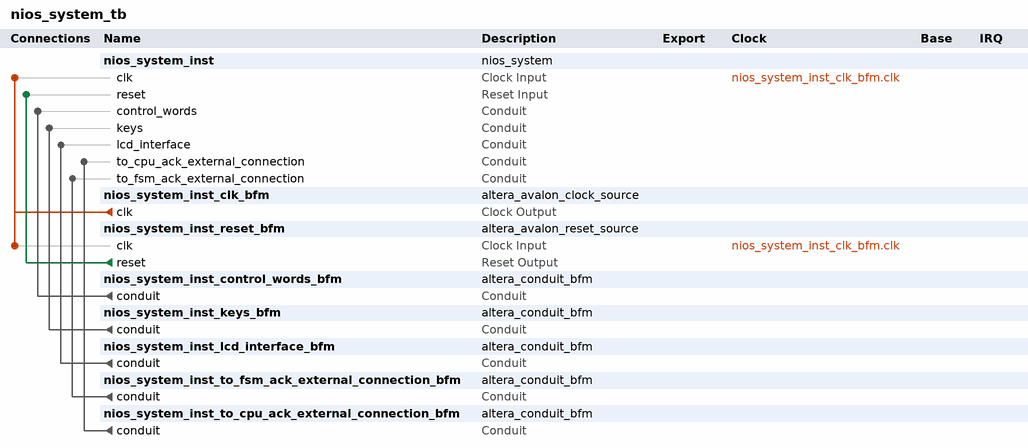
[diagram p0: system contents]
# Platform Designer (Qsys) system nios_system_tb, Cyclone IV E EP4CE115F29C7
# Parameters at their usual value, and those the tool derives, are not listed.
package require -exact qsys 13.0
create_system nios_system_tb
set_project_property DEVICE_FAMILY {Cyclone IV E}
set_project_property DEVICE EP4CE115F29C7

add_instance nios_system_inst nios_system 1.0

add_instance nios_system_inst_clk_bfm altera_avalon_clock_source 13.0

add_instance nios_system_inst_reset_bfm altera_avalon_reset_source 13.0
set_instance_parameter_value nios_system_inst_reset_bfm ASSERT_HIGH_RESET 0
set_instance_parameter_value nios_system_inst_reset_bfm INITIAL_RESET_CYCLES 50

add_instance nios_system_inst_control_words_bfm altera_conduit_bfm 13.0
set_instance_parameter_value nios_system_inst_control_words_bfm CLOCKED_SIGNAL false
set_instance_parameter_value nios_system_inst_control_words_bfm ENABLE_RESET false
set_instance_parameter_value nios_system_inst_control_words_bfm SIGNAL_WIDTHS 8
set_instance_parameter_value nios_system_inst_control_words_bfm SIGNAL_DIRECTIONS input

add_instance nios_system_inst_keys_bfm altera_conduit_bfm 13.0
set_instance_parameter_value nios_system_inst_keys_bfm CLOCKED_SIGNAL false
set_instance_parameter_value nios_system_inst_keys_bfm ENABLE_RESET false
set_instance_parameter_value nios_system_inst_keys_bfm SIGNAL_WIDTHS 3
set_instance_parameter_value nios_system_inst_keys_bfm SIGNAL_DIRECTIONS output

add_instance nios_system_inst_lcd_interface_bfm altera_conduit_bfm 13.0
set_instance_parameter_value nios_system_inst_lcd_interface_bfm CLOCKED_SIGNAL false
set_instance_parameter_value nios_system_inst_lcd_interface_bfm ENABLE_RESET false
set_instance_parameter_value nios_system_inst_lcd_interface_bfm SIGNAL_ROLES DATA,ON,BLON,EN,RS,RW
set_instance_parameter_value nios_system_inst_lcd_interface_bfm SIGNAL_WIDTHS 8,1,1,1,1,1
set_instance_parameter_value nios_system_inst_lcd_interface_bfm SIGNAL_DIRECTIONS bidir,input,input,input,input,input

add_instance nios_system_inst_to_fsm_ack_external_connection_bfm altera_conduit_bfm 13.0
set_instance_parameter_value nios_system_inst_to_fsm_ack_external_connection_bfm CLOCKED_SIGNAL false
set_instance_parameter_value nios_system_inst_to_fsm_ack_external_connection_bfm ENABLE_RESET false
set_instance_parameter_value nios_system_inst_to_fsm_ack_external_connection_bfm SIGNAL_WIDTHS 1
set_instance_parameter_value nios_system_inst_to_fsm_ack_external_connection_bfm SIGNAL_DIRECTIONS input

add_instance nios_system_inst_to_cpu_ack_external_connection_bfm altera_conduit_bfm 13.0
set_instance_parameter_value nios_system_inst_to_cpu_ack_external_connection_bfm CLOCKED_SIGNAL false
set_instance_parameter_value nios_system_inst_to_cpu_ack_external_connection_bfm ENABLE_RESET false
set_instance_parameter_value nios_system_inst_to_cpu_ack_external_connection_bfm SIGNAL_WIDTHS 1
set_instance_parameter_value nios_system_inst_to_cpu_ack_external_connection_bfm SIGNAL_DIRECTIONS output

# connections
add_connection nios_system_inst_clk_bfm.clk nios_system_inst.clk clock
add_connection nios_system_inst_clk_bfm.clk nios_system_inst_reset_bfm.clk clock
add_connection nios_system_inst_reset_bfm.reset nios_system_inst.reset reset
add_connection nios_system_inst_control_words_bfm.conduit nios_system_inst.control_words conduit
add_connection nios_system_inst_keys_bfm.conduit nios_system_inst.keys conduit
add_connection nios_system_inst_lcd_interface_bfm.conduit nios_system_inst.lcd_interface conduit
add_connection nios_system_inst_to_cpu_ack_external_connection_bfm.conduit nios_system_inst.to_cpu_ack_external_connection conduit
add_connection nios_system_inst_to_fsm_ack_external_connection_bfm.conduit nios_system_inst.to_fsm_ack_external_connection conduit

set_interconnect_requirement {$system} qsys_mm.clockCrossingAdapter HANDSHAKE
set_interconnect_requirement {$system} qsys_mm.maxAdditionalLatency 1

save_system nios_system_tb.qsys
